# Altium schematic sheet ADCInterface.SchDoc: =DocumentName
size A3; Organization: ORGANIZATION; Address1: R. Aprígio Veloso, 882, Universitário; Address2: Campina Grande - PB; Address3: 58429-900; Revision: -; SheetNumber: 7; SheetTotal: 7; ENG_DATE: --/--/--; DSN_DATE: --/--/--; CHK_DATE: --/--/--; SCH_SCALE: 1:1
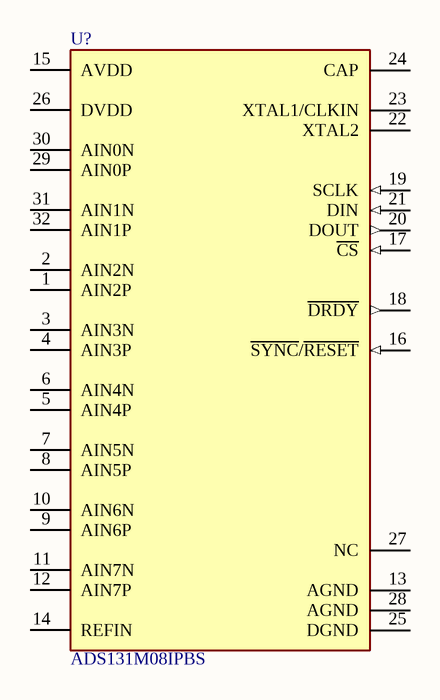
[diagram p0: ADCInterface.SchDoc]

## Parts
U?  ADS131M08IPBS  [FP-PBS0032A-MFG]

## Nets

Not connected (* = marked no-connect by the designer): U? 1(AIN2P) 2(AIN2N) 3(AIN3N) 4(AIN3P) 5(AIN4P) 6(AIN4N) 7(AIN5N) 8(AIN5P) 9(AIN6P) 10(AIN6N) 11(AIN7N) 12(AIN7P) 13(AGND) 14(REFIN) 15(AVDD) 16(~{SYNC}/~{RESET}) 17(~{CS}) 18(~{DRDY}) 19(SCLK) 20(DOUT) 21(DIN) 22(XTAL2) 23(XTAL1/CLKIN) 24(CAP) 25(DGND) 26(DVDD) 27(NC) 28(AGND) 29(AIN0P) 30(AIN0N) 31(AIN1N) 32(AIN1P)

## Notes on the sheet
- REVISION
- DESCRIPTION
- DATE
- APPROVED
- ADDRESS
- PROJECT
- VERSION
- TITLE
- A3
- SIZE
- SCALE
- DOCUMENT NAME:
- DOCUMENT REVISION:
- OF
- SHEET:
- PROJECT REVISION:

## Library data of the parts
U? = CMP-04860-000022-1: 8 CHANNEL 24 BIT SIMULTANEOUS SA